# Altium schematic sheet Wifi_RGB_v1.SchDoc
size A4
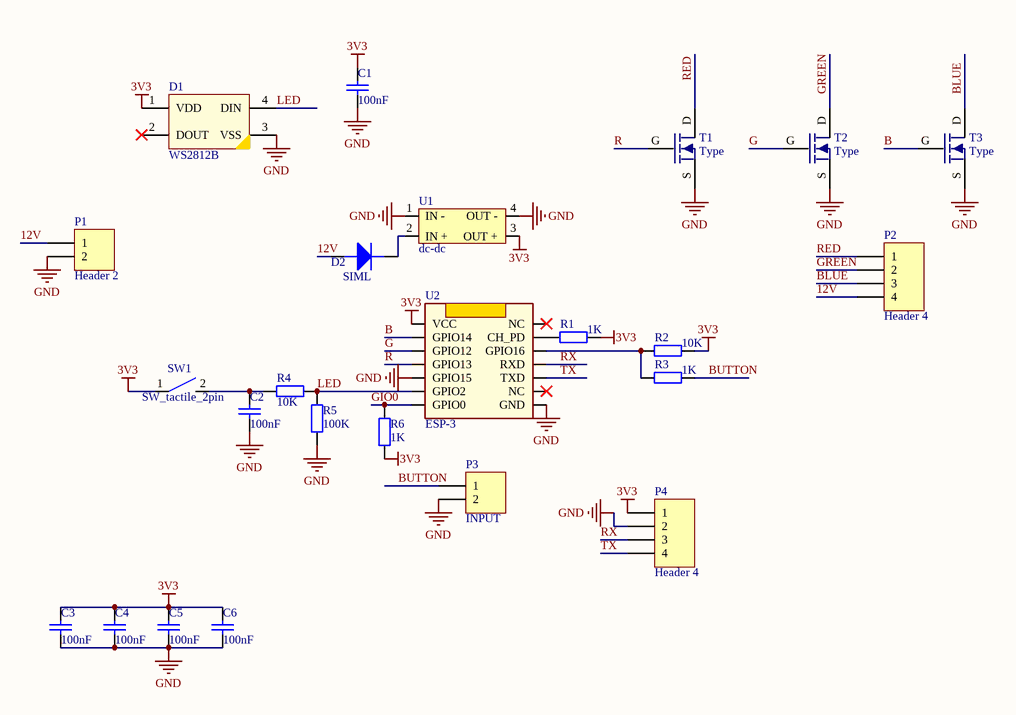
[diagram p0: Wifi_RGB_v1.SchDoc]

## Parts
C1  100nF  [FP_0603_CAP_080]
C2  100nF  [FP_0603_CAP_080]
C3  100nF  [FP_0603_CAP_080]
C4  100nF  [FP_0603_CAP_080]
C5  100nF  [FP_0603_CAP_080]
C6  100nF  [FP_0603_CAP_080]
D1  WS2812B  [LED_5050_4pin]
D2  SIML  [subsma]
P1  Header 2  [Sorkapocs 2P 5mm]
P2  Header 4  [Sorkapocs 4P 5mm]
P3  INPUT  [HDR1X2]
P4  Header 4  [HDR1X4]
R1  1K  [FP_0603_RES]
R2  10K  [FP_0603_RES]
R3  1K  [FP_0603_RES]
R4  10K  [FP_0603_RES]
R5  100K  [FP_0603_RES]
R6  1K  [FP_0603_RES]
SW1  SW_tactile_2pin  [SW_TACT_2PIN]
T1  Type  [FET_SOT23]
T2  Type  [FET_SOT23]
T3  Type  [FET_SOT23]
U1  dc-dc  [DC-DC modul]
U2  ESP-3  [ESP_3]

## Nets
3V3: C1.1 C3.1 C4.1 C5.1 C6.1 D1.1(VDD) P4.1 R1.1 R2.1 R6.2 SW1.1 U1.3(OUT_+) U2.1(VCC)
GND: C1.2 C2.2 C3.2 C4.2 C5.2 C6.2 D1.3(VSS) P1.2 P3.2 P4.2 R5.2 T1.S T2.S T3.S U1.1(IN_-) U1.4(OUT_-) U2.5(GPIO15) U2.8(GND)
12V: D2.A P1.1 P2.4
B: T3.G U2.2(GPIO14)
BLUE: P2.3 T3.D
BUTTON: P3.1 R3.1
G: T2.G U2.3(GPIO12)
GIO0: R6.1 U2.7(GPIO0)
GREEN: P2.2 T2.D
LED: D1.4(DIN) R4.2 R5.1 U2.6(GPIO2)
R: T1.G U2.4(GPIO13)
RED: P2.1 T1.D
RX: P4.3 U2.11(RXD)
TX: P4.4 U2.10(TXD)
NetC2_1: C2.1 R4.1 SW1.2
NetD2_K: D2.K U1.2(IN_+)
NetR1_2: R1.2 U2.13(CH_PD)
NetR2_2: R2.2 R3.2 U2.12(GPIO16)

Not connected (* = marked no-connect by the designer): D1 2(DOUT)*; U2 9(NC)* 14(NC)*

## Library data of the parts
C1-C6 = Cap: Capacitor; Leírás: Capacitor ceramic X7R; Value: 100nF; Order info: 82-04-85
D2 = DIODE_big: Order info: Lomex 83-00-35; Leírás: Diode 1A 1000V
P1 P3 = Header 2: Header, 2-Pin; LatestRevisionDate: 17-Jul-2002; LatestRevisionNote: Re-released for DXP Platform.; Publisher: Altium Limited
P2 P4 = Header 4: Header, 4-Pin; LatestRevisionDate: 17-Jul-2002; LatestRevisionNote: Re-released for DXP Platform.; Publisher: Altium Limited
R1 R3 R6 = Res3: Resistor; Value: 1K; Order info: 81-10-26; Leírás: Resistor
R2 R4 R5 = Res3: Resistor; Order info: TODO; Leírás: Resistor
  R2 R4: Value: 10K
  R5: Value: 100K
T1-T3 = NMOS
U1 = DC-DC modul: Step down dc-dc module
U2 = ESP-3: ESP-3wifi module